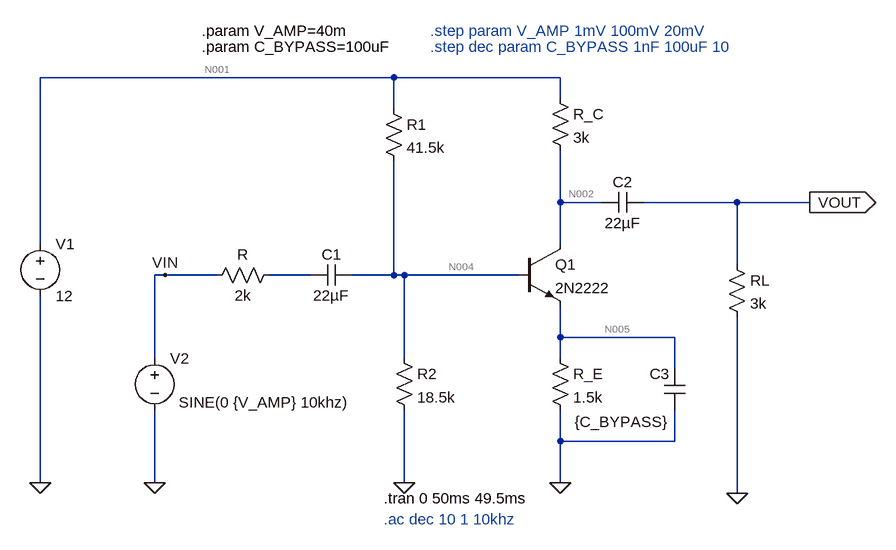
[diagram p0: schematic lab4part2.asc]
lab4part2.asc, the LTspice schematic file:
Version 4
SHEET 1 880 680
WIRE -64 -144 -608 -144
WIRE 192 -144 -64 -144
WIRE 192 -112 192 -144
WIRE -64 -96 -64 -144
WIRE 192 48 192 -32
WIRE 256 48 192 48
WIRE 464 48 320 48
WIRE 576 48 464 48
WIRE -608 112 -608 -144
WIRE 192 112 192 48
WIRE 464 144 464 48
WIRE -416 160 -432 160
WIRE -336 160 -416 160
WIRE -192 160 -256 160
WIRE -64 160 -64 -16
WIRE -64 160 -128 160
WIRE -48 160 -64 160
WIRE 128 160 -48 160
WIRE 192 256 192 208
WIRE 368 256 192 256
WIRE -432 288 -432 160
WIRE -48 288 -48 160
WIRE 192 288 192 256
WIRE 368 304 368 256
WIRE 192 416 192 368
WIRE 368 416 368 368
WIRE 368 416 192 416
WIRE -608 480 -608 192
WIRE -432 480 -432 368
WIRE -48 480 -48 368
WIRE 192 480 192 416
WIRE 464 496 464 224
FLAG -608 480 0
FLAG -48 480 0
FLAG 192 480 0
FLAG -432 480 0
FLAG 576 48 VOUT
IOPIN 576 48 Out
FLAG 464 496 0
FLAG -416 160 VIN
SYMBOL npn 128 112 R0
SYMATTR InstName Q1
SYMATTR Value 2N2222
SYMBOL res 176 -128 R0
SYMATTR InstName R_C
SYMATTR Value 3k
SYMBOL res 176 272 R0
SYMATTR InstName R_E
SYMATTR Value 1.5k
SYMBOL voltage -608 96 R0
WINDOW 123 0 0 Left 0
WINDOW 39 0 0 Left 0
SYMATTR InstName V1
SYMATTR Value 12
SYMBOL res -80 -112 R0
SYMATTR InstName R1
SYMATTR Value 41.5k
SYMBOL res -64 272 R0
SYMATTR InstName R2
SYMATTR Value 18.5k
SYMBOL res -240 144 R90
WINDOW 0 0 56 VBottom 2
WINDOW 3 32 56 VTop 2
SYMATTR InstName R
SYMATTR Value 2k
SYMBOL cap -128 144 R90
WINDOW 0 0 32 VBottom 2
WINDOW 3 32 32 VTop 2
SYMATTR InstName C1
SYMATTR Value 22µF
SYMBOL cap 320 32 R90
WINDOW 0 0 32 VBottom 2
WINDOW 3 32 32 VTop 2
SYMATTR InstName C2
SYMATTR Value 22µF
SYMBOL voltage -432 272 R0
WINDOW 3 37 84 Left 2
WINDOW 123 24 124 Left 2
WINDOW 39 0 0 Left 0
SYMATTR InstName V2
SYMATTR Value SINE(0 {V_AMP} 10khz)
SYMBOL res 448 128 R0
SYMATTR InstName RL
SYMATTR Value 3k
SYMBOL cap 384 368 R180
WINDOW 0 24 56 Left 2
WINDOW 3 28 -18 Left 2
SYMATTR InstName C3
SYMATTR Value {C_BYPASS}
TEXT -80 504 Left 2 !.tran 0 50ms 49.5ms
TEXT -80 536 Left 2 ;.ac dec 10 1 10khz
TEXT -360 -216 Left 2 !.param V_AMP=40m
TEXT -8 -216 Left 2 ;.step param V_AMP 1mV 100mV 20mV
TEXT -360 -192 Left 2 !.param C_BYPASS=100uF
TEXT -8 -192 Left 2 ;.step dec param C_BYPASS 1nF 100uF 10

The netlist it stands for:
* lab4part2.asc
Q1 N002 N004 N005 0 2N2222
R_C N001 N002 3k
R_E N005 0 1.5k
V1 N001 0 12
R1 N001 N004 41.5k
R2 N004 0 18.5k
R N003 VIN 2k
C1 N004 N003 22µF
C2 VOUT N002 22µF
V2 VIN 0 SINE(0 {V_AMP} 10khz)
RL VOUT 0 3k
C3 0 N005 {C_BYPASS}
.model NPN NPN
.model PNP PNP
.lib standard.bjt
.tran 0 50ms 49.5ms
* .ac dec 10 1 10khz
.param V_AMP=40m
* .step param V_AMP 1mV 100mV 20mV
.param C_BYPASS=100uF
* .step dec param C_BYPASS 1nF 100uF 10
.backanno
.end

* Results of the author's LTspice run, read from the files saved beside the schematic
* Operating Point, zero values left out:
*   V(n002) = 6.215 V
*   V(n004) = 3.579 V
*   V(n005) = 2.907 V
*   V(n001) = 12 V
*   Ic(Q1) = 1.928 mA
*   Ib(Q1) = 9.452 µA
*   Ie(Q1) = -1.938 mA
*   I(R_c) = 1.928 mA
*   I(R_e) = 1.938 mA
*   I(R1) = 202.9 µA
*   I(R2) = 193.5 µA
*   I(V1) = -2.131 mA
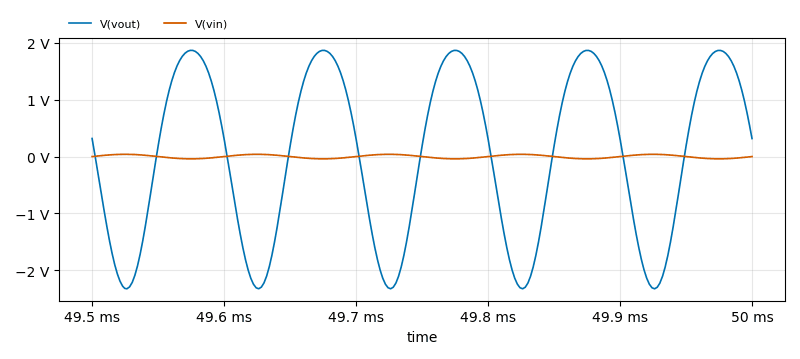
[diagram p1: Transient Analysis of lab4part2.asc, plotted from the saved traces]
* Transient Analysis, 1 run:
*   V(vout): min -2.328 V, max 1.87 V, average 7.316 mV, rms 1.502 V, last 317.2 mV
*   V(vin): min -39.97 mV, max 39.99 mV, average 98.81 nV, rms 28.28 mV, last 0 V